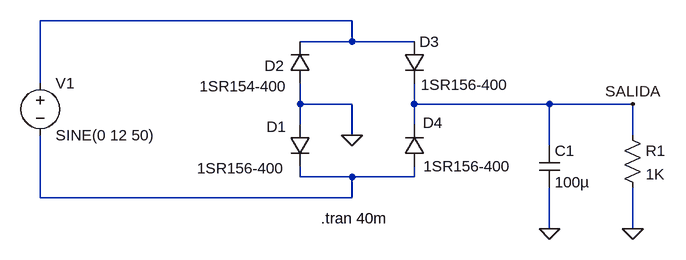
[diagram p0: schematic puente-rectificador-filtrado.asc]
puente-rectificador-filtrado.asc, the LTspice schematic file:
Version 4
SHEET 1 1804 680
WIRE 208 -16 -272 -16
WIRE 208 16 208 -16
WIRE 208 16 128 16
WIRE 304 16 208 16
WIRE -272 80 -272 -16
WIRE 128 112 128 80
WIRE 208 112 128 112
WIRE 304 112 304 80
WIRE 512 112 304 112
WIRE 640 112 512 112
WIRE 128 144 128 112
WIRE 304 144 304 112
WIRE 208 160 208 112
WIRE 640 160 640 112
WIRE 512 176 512 112
WIRE 128 224 128 208
WIRE 208 224 128 224
WIRE 304 224 304 208
WIRE 304 224 208 224
WIRE -272 256 -272 160
WIRE 208 256 208 224
WIRE 208 256 -272 256
WIRE 512 304 512 240
WIRE 640 304 640 240
FLAG 640 304 0
FLAG 640 112 SALIDA
FLAG 208 160 0
FLAG 512 304 0
SYMBOL diode 112 144 R0
WINDOW 0 -36 3 Left 2
WINDOW 3 206 64 Left 2
SYMATTR InstName D1
SYMATTR Value 1SR156-400
SYMBOL voltage -272 64 R0
WINDOW 123 0 0 Left 0
WINDOW 39 0 0 Left 0
SYMATTR InstName V1
SYMATTR Value SINE(0 12 50)
SYMBOL res 624 144 R0
SYMATTR InstName R1
SYMATTR Value 1K
SYMBOL diode 144 80 R180
WINDOW 0 40 27 Left 2
WINDOW 3 35 -5 Left 2
SYMATTR InstName D2
SYMATTR Value 1SR154-400
SYMBOL diode 288 16 R0
WINDOW 3 26 66 Left 2
SYMATTR Value 1SR156-400
SYMATTR InstName D3
SYMBOL diode 320 208 R180
WINDOW 0 -28 67 Left 2
WINDOW 3 215 -3 Left 2
SYMATTR InstName D4
SYMATTR Value 1SR156-400
SYMBOL cap 496 176 R0
SYMATTR InstName C1
SYMATTR Value 100µ
TEXT 160 288 Left 2 !.tran 40m

The netlist it stands for:
* puente-rectificador-filtrado.asc
D1 0 N002 1SR156-400
V1 N001 N002 SINE(0 12 50)
R1 SALIDA 0 1K
D2 0 N001 1SR154-400
D3 N001 SALIDA 1SR156-400
D4 N002 SALIDA 1SR156-400
C1 SALIDA 0 100µ
.model D D
.lib standard.dio
.tran 40m
.backanno
.end